# EAGLE schematic VR_78XX_1 (EAGLE 7.3.0)
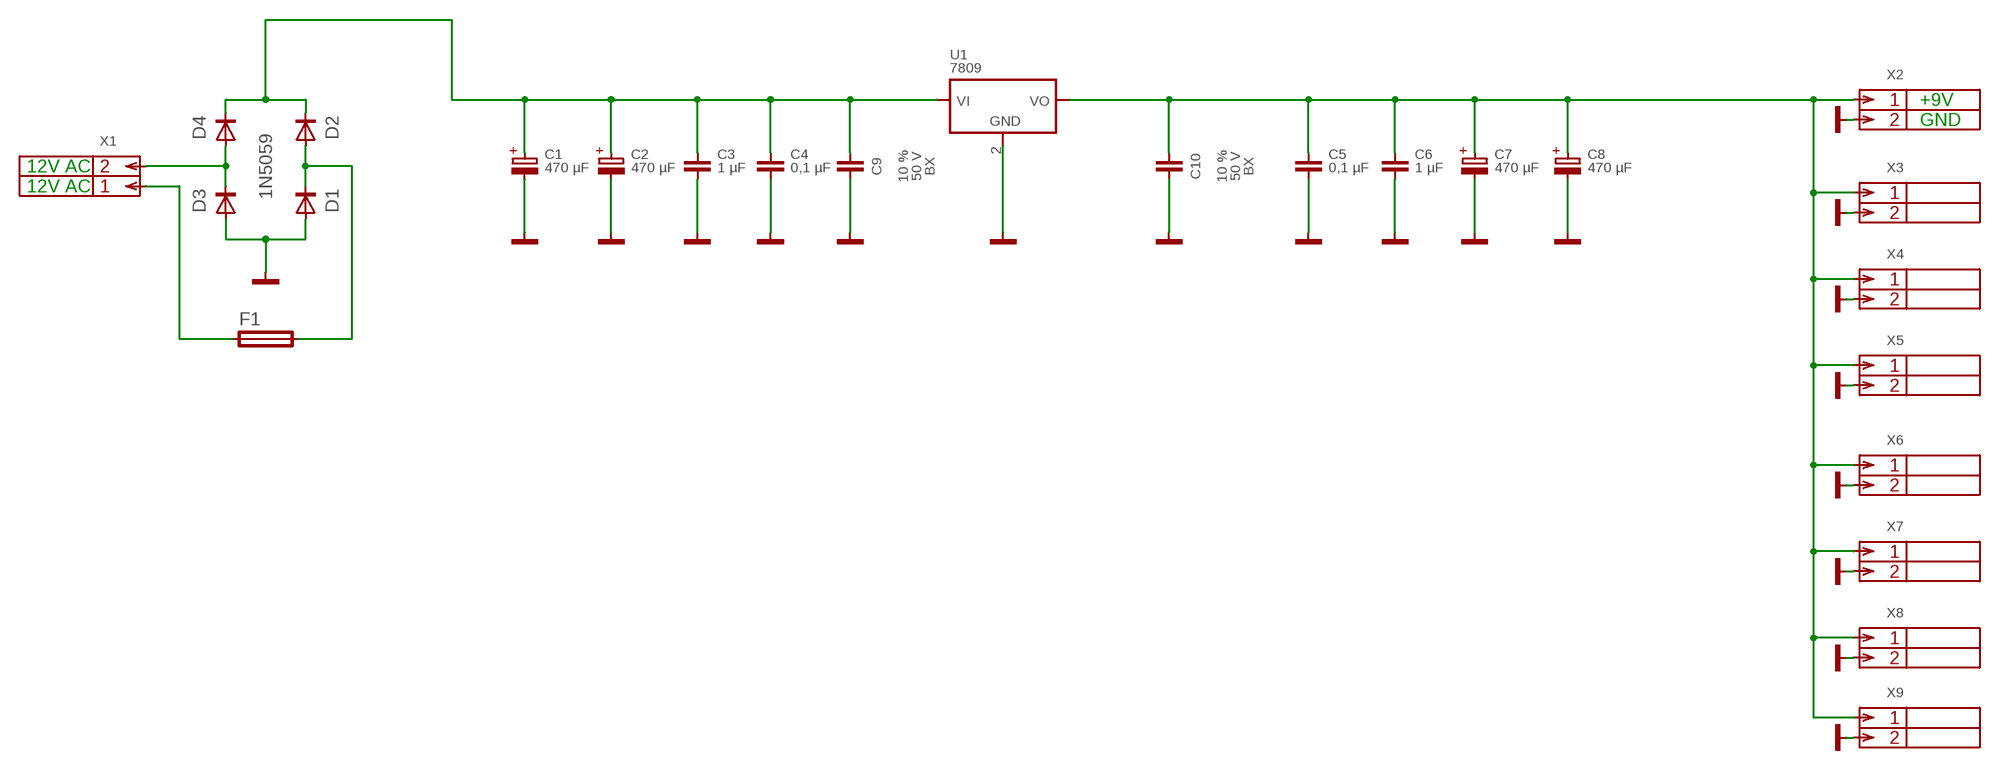
[diagram p0: schematic, sheet 1]

## Parts
C1  470 µF  BEYSHLAG-118AHT0  [BC10-30]
C2  470 µF  BEYSHLAG-118AHT0  [BC10-30]
C3  1 µF  1  [1]
C4  0,1 µF  0.1  [0.1]
C5  0,1 µF  0.1  [0.1]
C6  1 µF  1  [1]
C7  470 µF  BEYSHLAG-118AHT0  [BC10-30]
C8  470 µF  BEYSHLAG-118AHT0  [BC10-30]
C9  C-EU050-025X075  [C050-025X075]
C10  C-EU050-025X075  [C050-025X075]
D1  1N5059  [DO204-10]
D2  1N5059  [DO204-10]
D3  1N5059  [DO204-10]
D4  1N5059  [DO204-10]
F1  GSH15  [GSH15]
U1  7809  7805T  [TO220H]
X1  AK100V5  [AK100-2V]
X2  MTA02-100  [10X02MTA]
X3  MTA02-100  [10X02MTA]
X4  MTA02-100  [10X02MTA]
X5  MTA02-100  [10X02MTA]
X6  MTA02-100  [10X02MTA]
X7  MTA02-100  [10X02MTA]
X8  MTA02-100  [10X02MTA]
X9  MTA02-100  [10X02MTA]

## Nets
+5V: C5.1 C6.1 C7.+ C8.+ C10.1 U1.3(VO) X2.1 X3.1 X4.1 X5.1 X6.1 X7.1 X8.1 X9.1
GND: C1.- C2.- C3.2 C4.2 C5.2 C6.2 C7.- C8.- C9.2 C10.2 D1.A D3.A U1.2(GND) X2.2 X3.2 X4.2 X5.2 X6.2 X7.2 X8.2 X9.2
N$1: D3.C D4.A X1.P$2
N$2: D1.C D2.A F1.2
N$3: F1.1 X1.P$1
VDD2: C1.+ C2.+ C3.1 C4.1 C9.1 D2.C D4.C U1.1(VI)

## Notes on the sheet
- +9V
- GND
- 12V AC
- 12V AC

## Library data of the parts
C1 C2 C7 C8 = cap_vishay-pol_a:BEYSHLAG-118AHT: Vishay Beyshlag 118 AHT series polar capacitor.
C3 C6 = CDE_DMM:1
C4 C5 = CDE_DPM:0.1
C9 C10 = rcl_a:C-EU: CAPACITOR, European symbol; DIELECTRIC: BX; TOLERANCE: 10 %; VOLTAGE: 50 V
D1-D4 = diode_a:1N5059: DIODE controlled avalanche rectifier
F1 = fuse_a:GSH15: FUSE HOLDER grid 15mm, 19649 Wickmann
U1 = linear_a:78*: Positive VOLTAGE REGULATOR Source: http://cache.national.com/ds/LM/LM78L05.pdf http://www.fairchildsemi.com/ds/LM/LM7805.pdf
X1 = CON-AK100_a:AK100V
X2-X9 = con-amp_a:MTA02-100: AMP connector